# EAGLE schematic Tarjeta (EAGLE 9.6.2)

## Sheet 1 of 3
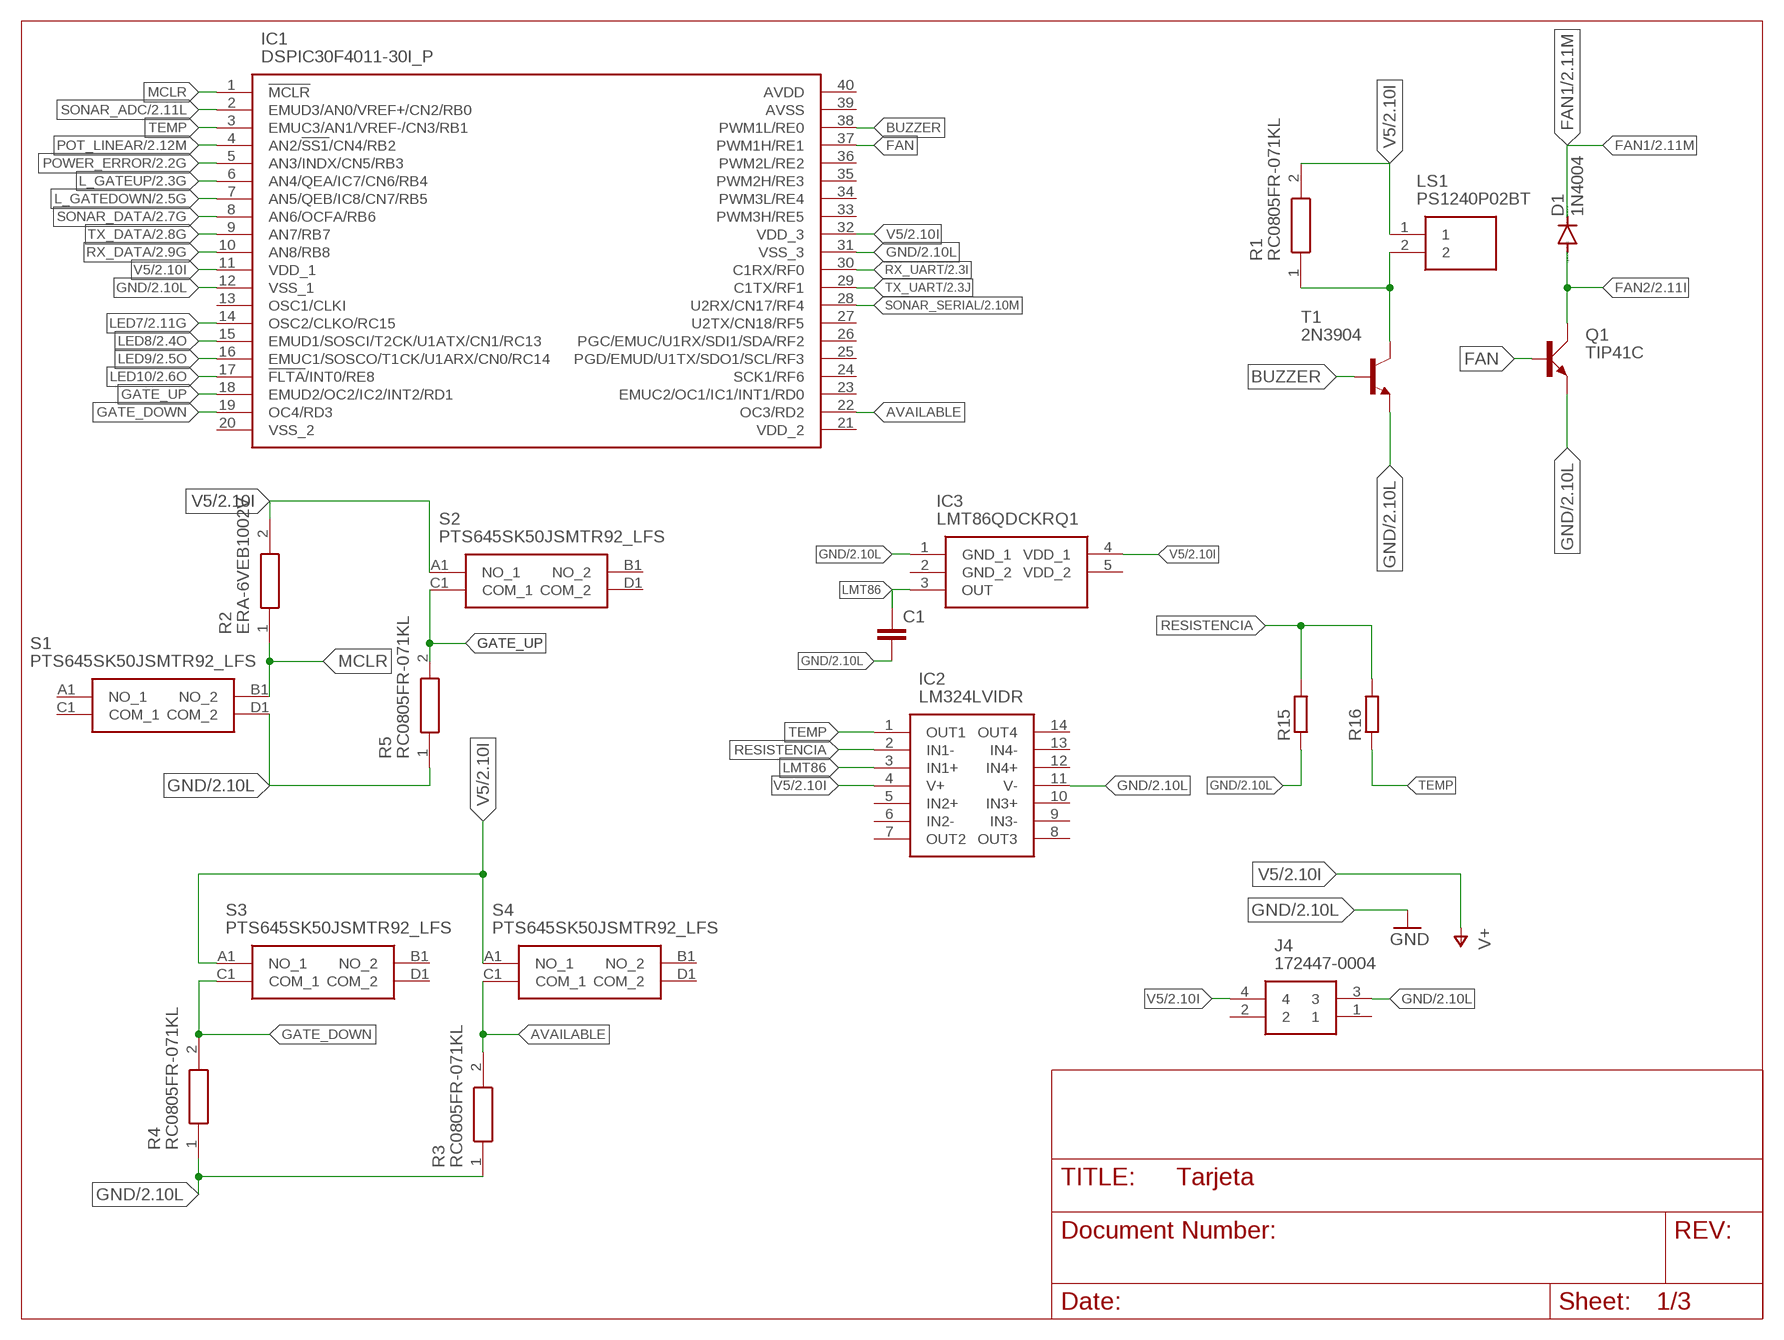
[diagram p0: schematic, sheet 1]

### Parts
C1  C-EUC0805  [C0805]
D1  1N4004  [DO41-10]
IC1  DSPIC30F4011-30I_P  [DIP1543W58P254L5175H635Q40N]
IC2  LM324LVIDR  [SOIC127P600X175-14N]
IC3  LMT86QDCKRQ1  [SOT65P210X110-5N]
J4  172447-0004  [1724470004]
LS1  PS1240P02BT  [PS1240P02BT]
Q1  TIP41C  [TO220AV]
R1  RC0805FR-071KL  [RESC2012X60N]
R2  ERA-6VEB1002V  [RESC2012X65N]
R3  RC0805FR-071KL  [RESC2012X60N]
R4  RC0805FR-071KL  [RESC2012X60N]
R5  RC0805FR-071KL  [RESC2012X60N]
R15  R-EU_0204/7  [0204/7]
R16  R-EU_0204/7  [0204/7]
S1  PTS645SK50JSMTR92_LFS  [PTS645SK50JSMTR92LFS]
S2  PTS645SK50JSMTR92_LFS  [PTS645SK50JSMTR92LFS]
S3  PTS645SK50JSMTR92_LFS  [PTS645SK50JSMTR92LFS]
S4  PTS645SK50JSMTR92_LFS  [PTS645SK50JSMTR92LFS]
T1  2N3904  [TO92]

### Nets
AVAILABLE: IC1.22(OC3/RD2) R3.2 S4.C1(COM_1)
BUZZER: IC1.38(PWM1L/RE0) T1.2(B)
FAN: IC1.37(PWM1H/RE1) Q1.B
FAN1: D1.C ; also sheet 2
FAN2: D1.A Q1.C ; also sheet 2
GATE_DOWN: IC1.19(OC4/RD3) R4.2 S3.C1(COM_1)
GATE_UP: IC1.18(EMUD2/OC2/IC2/INT2/RD1) R5.2 S2.C1(COM_1)
GND: C1.2 IC1.12(VSS_1) IC1.31(VSS_3) IC2.11(V-) IC3.1(GND_1) J4.3 Q1.E R3.1 R4.1 R5.1 R15.1 S1.D1(COM_2) T1.3(E) ; also sheet 2,3
L_GATEDOWN: IC1.7(AN5/QEB/IC8/CN7/RB5) ; also sheet 2
L_GATEUP: IC1.6(AN4/QEA/IC7/CN6/RB4) ; also sheet 2
LED7: IC1.14(OSC2/CLKO/RC15) ; also sheet 2
LED8: IC1.15(EMUD1/SOSCI/T2CK/U1ATX/CN1/RC13) ; also sheet 2
LED9: IC1.16(EMUC1/SOSCO/T1CK/U1ARX/CN0/RC14) ; also sheet 2
LED10: IC1.17(!FLTA!/INT0/RE8) ; also sheet 2
LMT86: C1.1 IC2.3(IN1+) IC3.3(OUT)
MCLR: IC1.1(!MCLR) R2.1 S1.B1(NO_2)
N$3: LS1.2 R1.1 T1.1(C)
POT_LINEAR: IC1.4(AN2/!SS1!/CN4/RB2) ; also sheet 2
POWER_ERROR: IC1.5(AN3/INDX/CN5/RB3) ; also sheet 2
RESISTENCIA: IC2.2(IN1-) R15.2 R16.2
RX_DATA: IC1.10(AN8/RB8) ; also sheet 2
RX_UART: IC1.30(C1RX/RF0) ; also sheet 2
SONAR_ADC: IC1.2(EMUD3/AN0/VREF+/CN2/RB0) ; also sheet 2
SONAR_DATA: IC1.8(AN6/OCFA/RB6) ; also sheet 2
SONAR_SERIAL: IC1.28(U2RX/CN17/RF4) ; also sheet 2
TEMP: IC1.3(EMUC3/AN1/VREF-/CN3/RB1) IC2.1(OUT1) R16.1
TX_DATA: IC1.9(AN7/RB7) ; also sheet 2
TX_UART: IC1.29(C1TX/RF1) ; also sheet 2
V5: IC1.11(VDD_1) IC1.32(VDD_3) IC2.4(V+) IC3.4(VDD_1) J4.4 LS1.1 R1.2 R2.2 S2.A1(NO_1) S3.A1(NO_1) S4.A1(NO_1) ; supply symbol labelled V+ ; also sheet 2,3
Unconnected: IC1.13(OSC1/CLKI) IC1.20(VSS_2) IC1.21(VDD_2) IC1.23(EMUC2/OC1/IC1/INT1/RD0) IC1.24(SCK1/RF6) IC1.25(PGD/EMUD/U1TX/SDO1/SCL/RF3) IC1.26(PGC/EMUC/U1RX/SDI1/SDA/RF2) IC1.27(U2TX/CN18/RF5) IC1.33(PWM3H/RE5) IC1.34(PWM3L/RE4) IC1.35(PWM2H/RE3) IC1.36(PWM2L/RE2) IC1.39(AVSS) IC1.40(AVDD) IC2.5(IN2+) IC2.6(IN2-) IC2.7(OUT2) IC2.8(OUT3) IC2.9(IN3-) IC2.10(IN3+) IC2.12(IN4+) IC2.13(IN4-) IC2.14(OUT4) IC3.2(GND_2) IC3.5(VDD_2) J4.1 J4.2 S1.A1(NO_1) S1.C1(COM_1) S2.B1(NO_2) S2.D1(COM_2) S3.B1(NO_2) S3.D1(COM_2) S4.B1(NO_2) S4.D1(COM_2)

## Sheet 2 of 3
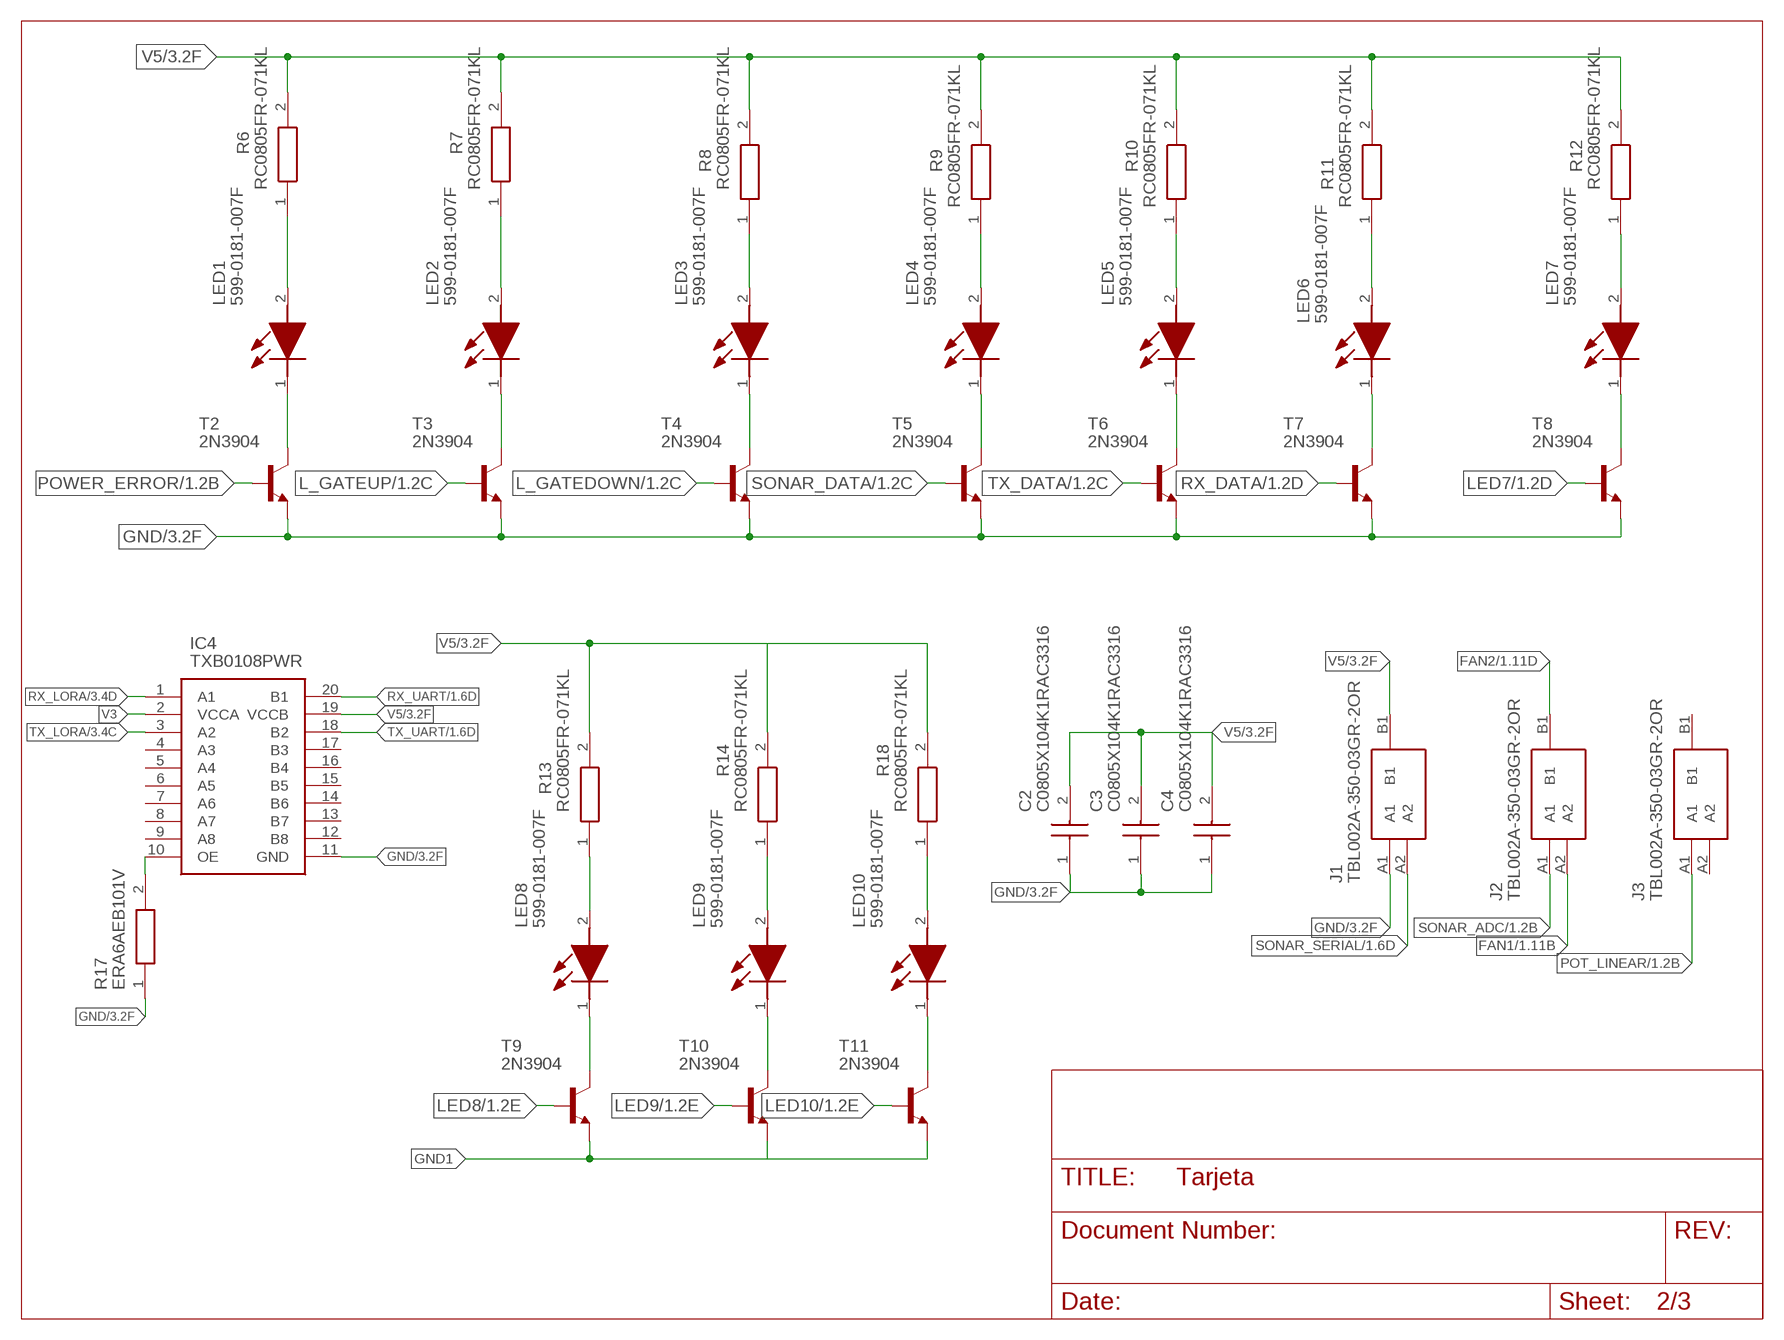
[diagram p1: schematic, sheet 2]

### Parts
C2  C0805X104K1RAC3316  [CAPC2012X100N]
C3  C0805X104K1RAC3316  [CAPC2012X100N]
C4  C0805X104K1RAC3316  [CAPC2012X100N]
IC4  TXB0108PWR  [SOP65P640X120-20N]
J1  TBL002A-350-03GR-2OR  [TBL002A35003GR2OR]
J2  TBL002A-350-03GR-2OR  [TBL002A35003GR2OR]
J3  TBL002A-350-03GR-2OR  [TBL002A35003GR2OR]
LED1  599-0181-007F  [LEDC2012X70N]
LED2  599-0181-007F  [LEDC2012X70N]
LED3  599-0181-007F  [LEDC2012X70N]
LED4  599-0181-007F  [LEDC2012X70N]
LED5  599-0181-007F  [LEDC2012X70N]
LED6  599-0181-007F  [LEDC2012X70N]
LED7  599-0181-007F  [LEDC2012X70N]
LED8  599-0181-007F  [LEDC2012X70N]
LED9  599-0181-007F  [LEDC2012X70N]
LED10  599-0181-007F  [LEDC2012X70N]
R6  RC0805FR-071KL  [RESC2012X60N]
R7  RC0805FR-071KL  [RESC2012X60N]
R8  RC0805FR-071KL  [RESC2012X60N]
R9  RC0805FR-071KL  [RESC2012X60N]
R10  RC0805FR-071KL  [RESC2012X60N]
R11  RC0805FR-071KL  [RESC2012X60N]
R12  RC0805FR-071KL  [RESC2012X60N]
R13  RC0805FR-071KL  [RESC2012X60N]
R14  RC0805FR-071KL  [RESC2012X60N]
R17  ERA6AEB101V  [RESC2012X60N]
R18  RC0805FR-071KL  [RESC2012X60N]
T2  2N3904  [TO92]
T3  2N3904  [TO92]
T4  2N3904  [TO92]
T5  2N3904  [TO92]
T6  2N3904  [TO92]
T7  2N3904  [TO92]
T8  2N3904  [TO92]
T9  2N3904  [TO92]
T10  2N3904  [TO92]
T11  2N3904  [TO92]

### Nets
FAN1: J2.A2 ; also sheet 1
FAN2: J2.B1 ; also sheet 1
GND: C2.1 C3.1 C4.1 IC4.11(GND) J1.A1 R17.1 T2.3(E) T3.3(E) T4.3(E) T5.3(E) T6.3(E) T7.3(E) T8.3(E) ; also sheet 1,3
GND1: T9.3(E) T10.3(E)
GND2: T11.3(E)
L_GATEDOWN: T4.2(B) ; also sheet 1
L_GATEUP: T3.2(B) ; also sheet 1
LED7: T8.2(B) ; also sheet 1
LED8: T9.2(B) ; also sheet 1
LED9: T10.2(B) ; also sheet 1
LED10: T11.2(B) ; also sheet 1
N$1: LED10.1(K) T11.1(C)
N$2: LED1.2(A) R6.1
N$4: LED1.1(K) T2.1(C)
N$5: LED2.1(K) T3.1(C)
N$6: LED2.2(A) R7.1
N$7: LED3.1(K) T4.1(C)
N$8: LED4.1(K) T5.1(C)
N$9: LED5.1(K) T6.1(C)
N$10: LED3.2(A) R8.1
N$11: LED4.2(A) R9.1
N$12: LED6.1(K) T7.1(C)
N$13: LED7.1(K) T8.1(C)
N$14: LED8.1(K) T9.1(C)
N$15: LED9.1(K) T10.1(C)
N$16: LED5.2(A) R10.1
N$17: LED6.2(A) R11.1
N$18: LED7.2(A) R12.1
N$19: LED8.2(A) R13.1
N$20: IC4.10(OE) R17.2
N$21: LED9.2(A) R14.1
N$22: LED10.2(A) R18.1
POT_LINEAR: J3.A1 ; also sheet 1
POWER_ERROR: T2.2(B) ; also sheet 1
RX_DATA: T7.2(B) ; also sheet 1
RX_LORA: IC4.1(A1) ; also sheet 3
RX_UART: IC4.20(B1) ; also sheet 1
SONAR_ADC: J2.A1 ; also sheet 1
SONAR_DATA: T5.2(B) ; also sheet 1
SONAR_SERIAL: J1.A2 ; also sheet 1
TX_DATA: T6.2(B) ; also sheet 1
TX_LORA: IC4.3(A2) ; also sheet 3
TX_UART: IC4.18(B2) ; also sheet 1
V1: R18.2
V3: IC4.2(VCCA)
V5: C2.2 C3.2 C4.2 IC4.19(VCCB) J1.B1 R6.2 R7.2 R8.2 R9.2 R10.2 R11.2 R12.2 R13.2 R14.2 ; also sheet 1,3
Unconnected: IC4.4(A3) IC4.5(A4) IC4.6(A5) IC4.7(A6) IC4.8(A7) IC4.9(A8) IC4.12(B8) IC4.13(B7) IC4.14(B6) IC4.15(B5) IC4.16(B4) IC4.17(B3) J3.A2 J3.B1

## Sheet 3 of 3
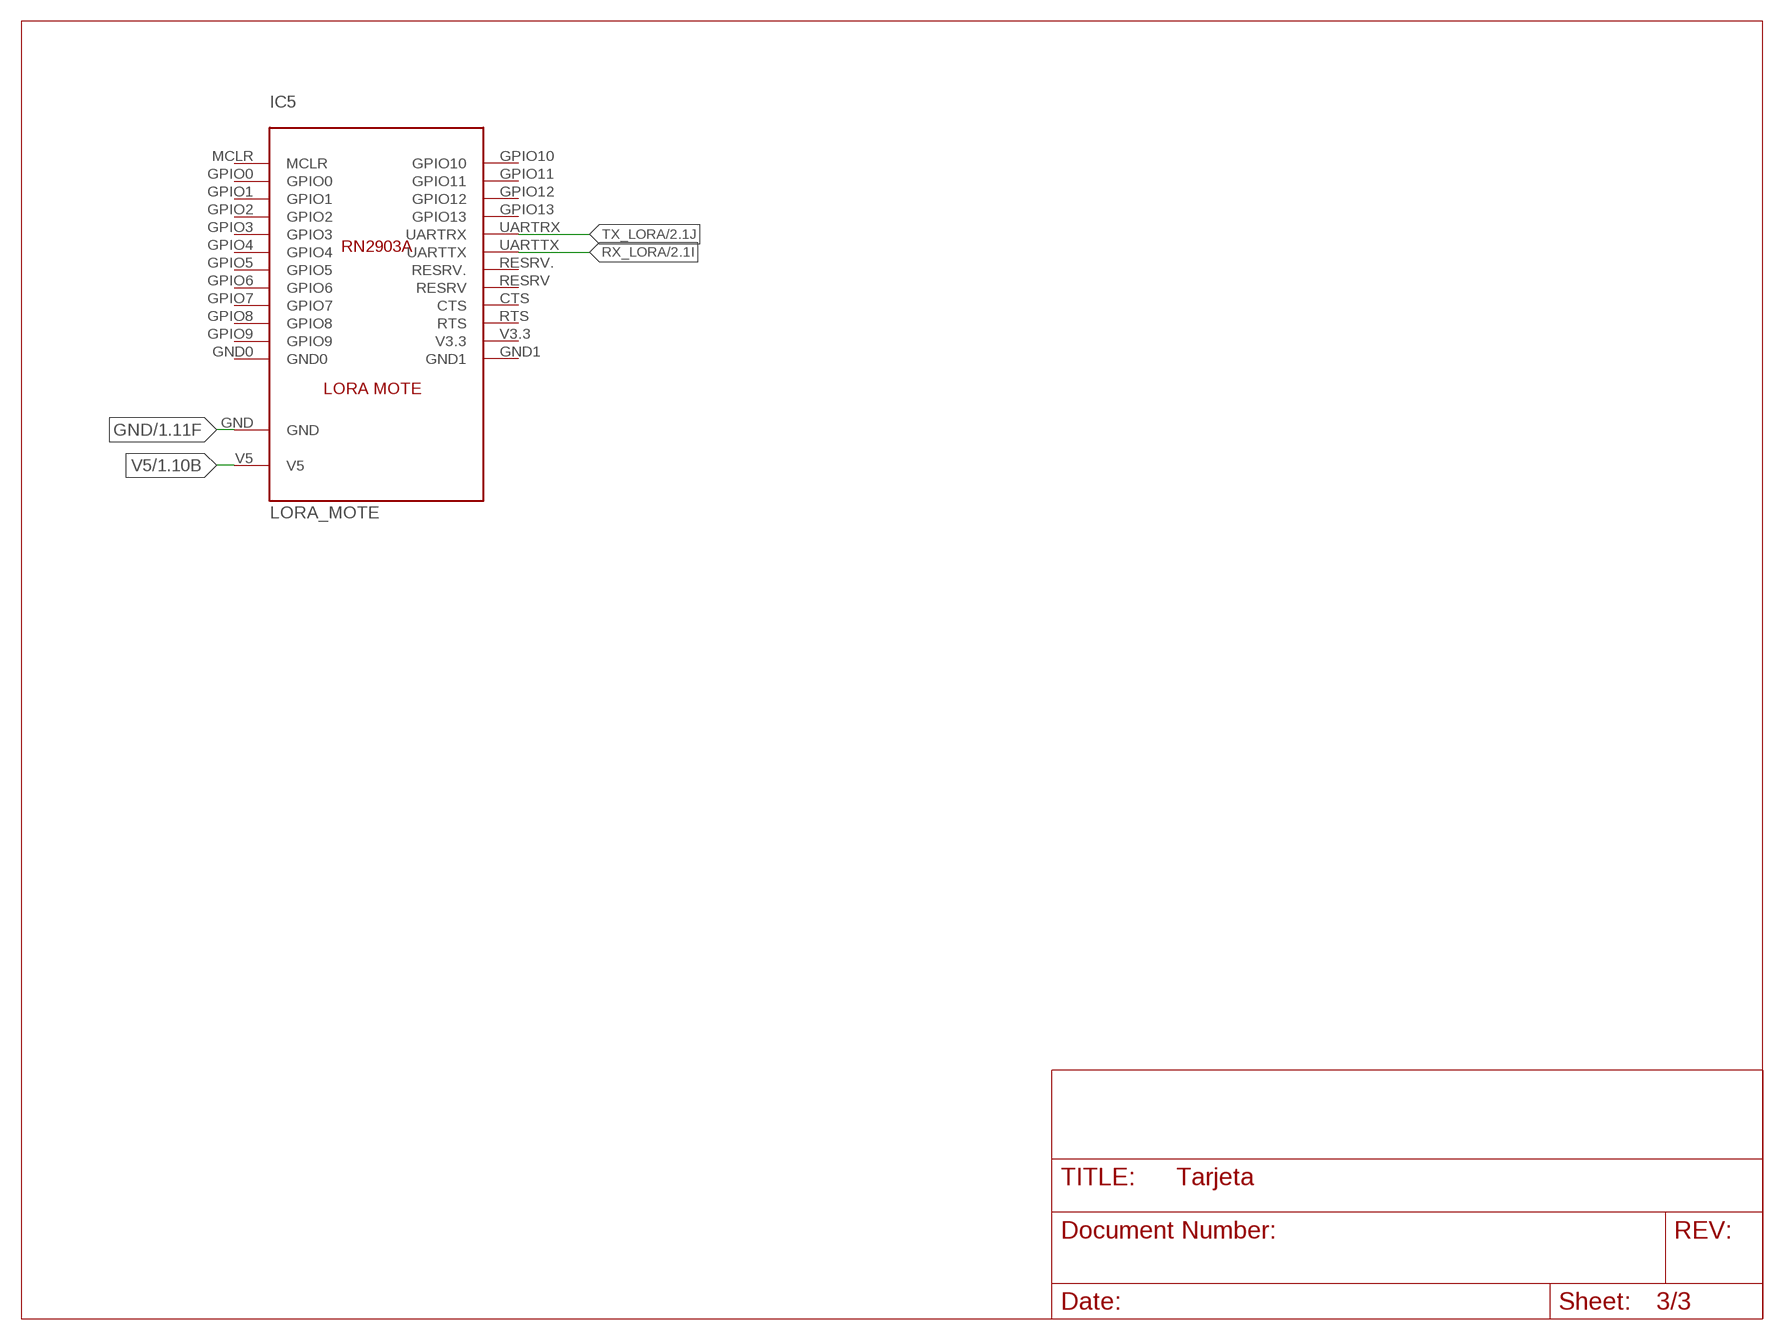
[diagram p2: schematic, sheet 3]

### Parts
IC5  LORA_MOTE  [LORA_MOTE_RN2903]

### Nets
GND: IC5.GND ; also sheet 1,2
RX_LORA: IC5.UARTTX ; also sheet 2
TX_LORA: IC5.UARTRX ; also sheet 2
V5: IC5.V5 ; also sheet 1,2
Unconnected: IC5.CTS IC5.GND0 IC5.GND1 IC5.GPIO0 IC5.GPIO1 IC5.GPIO2 IC5.GPIO3 IC5.GPIO4 IC5.GPIO5 IC5.GPIO6 IC5.GPIO7 IC5.GPIO8 IC5.GPIO9 IC5.GPIO10 IC5.GPIO11 IC5.GPIO12 IC5.GPIO13 IC5.MCLR IC5.RESRV IC5.RESRV. IC5.RTS IC5.V3.3

## Library data of the parts
C1 = rcl:C-EU: CAPACITOR, European symbol; SPICEPREFIX: C
C2-C4 = C0805X104K1RAC3316:C0805X104K1RAC3316: Multilayer Ceramic Capacitors MLCC - SMD/SMT 100V .1uF X7R AUTO 5mm Flex VW80808 Source: Datasheet <https://api.kemet.com/component-edge/download/datasheet/C0805X104K1RAC3316.pdf>; DESCRIPTION: Multilayer Ceramic Capacitors MLCC - SMD/SMT 100V .1uF X7R AUTO 5mm Flex VW80808; HEIGHT: 1mm; MANUFACTURER_NAME: Kemet; MANUFACTURER_PART_NUMBER: C0805X104K1RAC3316; MOUSER_PART_NUMBER: 80-C0805X104K1R3316; MOUSER_PRICE-STOCK: https://www.mouser.co.uk/ProductDetail/KEMET/C0805X104K1RAC3316/?qs=l7cgNqFNU1gwaeaoie4AnQ%3D%3D
D1 = diode:1N4004: DIODE general purpose rectifier, 1 A
IC1 = DSPIC30F4011-30I_P:DSPIC30F4011-30I_P: Digital Signal Controllers Source: Datasheet <https://componentsearchengine.com/Datasheets/5/DSPIC30F4011-30I_P.pdf>; ARROW_PART_NUMBER: dsPIC30F4011-30I/P; ARROW_PRICE-STOCK: https://www.arrow.com/en/products/dspic30f4011-30ip/microchip-technology; DESCRIPTION: Digital Signal Controllers; HEIGHT: 6.35mm; MANUFACTURER_NAME: Microchip; MANUFACTURER_PART_NUMBER: DSPIC30F4011-30I/P; MOUSER_PART_NUMBER: 579-30F4011-30I/P; MOUSER_PRICE-STOCK: https://www.mouser.co.uk/ProductDetail/Microchip-Technology/dsPIC30F4011-30I-P?qs=nMCt4TBfEwpnzUUd8LIZNg%3D%3D
IC2 = LM324LVIDR:LM324LVIDR: 4-Channel Industry Standard Low Voltage Operational Amplifier Source: Datasheet <http://www.ti.com/lit/gpn/lm324lv>; ARROW_PART_NUMBER: LM324LVIDR; ARROW_PRICE-STOCK: https://www.arrow.com/en/products/lm324lvidr/texas-instruments; DESCRIPTION: 4-Channel Industry Standard Low Voltage Operational Amplifier; HEIGHT: 1.75mm; MANUFACTURER_NAME: Texas Instruments; MANUFACTURER_PART_NUMBER: LM324LVIDR; MOUSER_PART_NUMBER: 595-LM324LVIDR; MOUSER_PRICE-STOCK: https://www.mouser.co.uk/ProductDetail/Texas-Instruments/LM324LVIDR/?qs=qSfuJ%252Bfl%2Fd62Uwb7PBNJ4g%3D%3D
IC3 = LMT86QDCKRQ1:LMT86QDCKRQ1: Automotive Grade, 2.2V-Capable, 10 uA Analog Output Temperature Sensor Source: Datasheet <http://www.ti.com/lit/gpn/lmt86-q1>; DESCRIPTION: Automotive Grade, 2.2V-Capable, 10 uA Analog Output Temperature Sensor; HEIGHT: 1.1mm; MANUFACTURER_NAME: Texas Instruments; MANUFACTURER_PART_NUMBER: LMT86QDCKRQ1; MOUSER_PART_NUMBER: 595-LMT86QDCKRQ1; MOUSER_PRICE-STOCK: https://www.mouser.co.uk/ProductDetail/Texas-Instruments/LMT86QDCKRQ1/?qs=xopfAcLiCQTZSXomKixV%2FQ%3D%3D
IC4 = TXB0108PWR:TXB0108PWR: 8-Bit Bidirectional Voltage-Level Shifter with Auto Direction Sensing and +/-15-kV ESD Protect Source: Datasheet <http://www.ti.com/lit/ds/symlink/txb0108.pdf>; DESCRIPTION: 8-Bit Bidirectional Voltage-Level Shifter with Auto Direction Sensing and +/-15-kV ESD Protect; HEIGHT: 1.2mm; MANUFACTURER_NAME: Texas Instruments; MANUFACTURER_PART_NUMBER: TXB0108PWR; MOUSER_PART_NUMBER: 595-TXB0108PWR; MOUSER_PRICE-STOCK: https://www.mouser.co.uk/ProductDetail/Texas-Instruments/TXB0108PWR/?qs=oFXvjAmG9EgEUWGWzOVFCA%3D%3D
IC5 = LORA_MOTE:LORA_MOTE
J1-J3 = TBL002A-350-03GR-2OR:TBL002A-350-03GR-2OR: Fixed Terminal Blocks Terminal block, screwless, 3.50, 45, 3 poles, green w orange tab Source: Datasheet <https://www.mouser.fr/datasheet/2/670/tbl002a-350-1600859.pdf>; DESCRIPTION: Fixed Terminal Blocks Terminal block, screwless, 3.50, 45, 3 poles, green w orange tab; HEIGHT: 12.85mm; MANUFACTURER_NAME: CUI Inc.; MANUFACTURER_PART_NUMBER: TBL002A-350-03GR-2OR; MOUSER_PART_NUMBER: 490-TBL002A3503GR2OR; MOUSER_PRICE-STOCK: https://www.mouser.co.uk/ProductDetail/CUI-Devices/TBL002A-350-03GR-2OR?qs=PzGy0jfpSMsNR2AeoCll%252Bw%3D%3D
J4 = 172447-0004:172447-0004: Power to the Board MiniFitJr Vert Hdr w/Pegs 4Ckt GlowWire Source: Datasheet <https://componentsearchengine.com/Datasheets/1/172447-0004.pdf>; DESCRIPTION: Power to the Board MiniFitJr Vert Hdr w/Pegs 4Ckt GlowWire; HEIGHT: 13.3mm; MANUFACTURER_NAME: Molex; MANUFACTURER_PART_NUMBER: 172447-0004; MOUSER_PART_NUMBER: 538-172447-0004; MOUSER_PRICE-STOCK: https://www.mouser.com/Search/Refine.aspx?Keyword=538-172447-0004
LED1-LED10 = 599-0181-007F:599-0181-007F: Standard LEDs - SMD SMD 0805 GREEN Source: Datasheet <http://www.mouser.com/datasheet/2/109/Dialight_CBI_data_599-0805_Apr2018-1370606.pdf>; DESCRIPTION: Standard LEDs - SMD SMD 0805 GREEN; HEIGHT: 0.7mm; MANUFACTURER_NAME: Dialight; MANUFACTURER_PART_NUMBER: 599-0181-007F; MOUSER_PART_NUMBER: 645-599-0181-007F; MOUSER_PRICE-STOCK: https://www.mouser.co.uk/ProductDetail/Dialight/599-0181-007F?qs=gTYE2QTfZfRUSax8JbgA2w%3D%3D
LS1 = PS1240P02BT:PS1240P02BT: Audio Indicators & Alerts Round 12.2mmx6.5mm 4kHz Vin=3V Source: Datasheet; DESCRIPTION: Audio Indicators & Alerts Round 12.2mmx6.5mm 4kHz Vin=3V; HEIGHT: mm; MANUFACTURER_NAME: TDK; MANUFACTURER_PART_NUMBER: PS1240P02BT; MOUSER_PART_NUMBER: 810-PS1240P02BT; MOUSER_PRICE-STOCK: https://www.mouser.co.uk/ProductDetail/TDK/PS1240P02BT/?qs=d7g9p1yFhWaZXSY9MjKMkw%3D%3D
Q1 = transistor-power:TIP41C: NPN TRANSISTOR
R1 R3-R14 R18 = RC0805FR-071KL:RC0805FR-071KL: GENERAL PURPOSE CHIP RESISTORS Source: Datasheet <http://www.yageo.com/documents/recent/PYu-RC_Group_51_RoHS_L_10.pdf>; DESCRIPTION: GENERAL PURPOSE CHIP RESISTORS; HEIGHT: 0.6mm; MANUFACTURER_NAME: YAGEO (PHYCOMP); MANUFACTURER_PART_NUMBER: RC0805FR-071KL; MOUSER_PART_NUMBER: 603-RC0805FR-071KL; MOUSER_PRICE-STOCK: https://www.mouser.co.uk/ProductDetail/Yageo/RC0805FR-071KL?qs=1ogmaHw32WJjeGY0DHXakQ%3D%3D
R2 = ERA-6VEB1002V:ERA-6VEB1002V: Thin Film Resistors - SMD 0805 0.1% 10Kohm 25ppm SMD Source: Datasheet <https://componentsearchengine.com/Datasheets/2/ERA-6VEB1002V.pdf>; DESCRIPTION: Thin Film Resistors - SMD 0805 0.1% 10Kohm 25ppm SMD; HEIGHT: 0.65mm; MANUFACTURER_NAME: Panasonic; MANUFACTURER_PART_NUMBER: ERA-6VEB1002V; MOUSER_PART_NUMBER: 667-ERA-6VEB1002V; MOUSER_PRICE-STOCK: https://www.mouser.co.uk/ProductDetail/Panasonic/ERA-6VEB1002V?qs=rI7uf1IzohQqQPsypW%252B%252B1w%3D%3D
R15 R16 = rcl:R-EU_: RESISTOR, European symbol; SPICEPREFIX: R
R17 = ERA6AEB101V:ERA6AEB101V: Panasonic ERA Series Thin Film Surface Mount Resistor 0805 Case 100 +/-0.1% 0.125W +/-25ppm/C Source: Datasheet <https://industrial.panasonic.com/cdbs/www-data/pdf/RDM0000/AOA0000C307.pdf>; ARROW_PART_NUMBER: ERA6AEB101V; ARROW_PRICE-STOCK: https://www.arrow.com/en/products/era-6aeb101v/panasonic; DESCRIPTION: Panasonic ERA Series Thin Film Surface Mount Resistor 0805 Case 100 +/-0.1% 0.125W +/-25ppm/C; HEIGHT: 0.6mm; MANUFACTURER_NAME: Panasonic; MANUFACTURER_PART_NUMBER: ERA6AEB101V
S1-S4 = Switche button:PTS645SK50JSMTR92_LFS: Tactile Switches 50mA 12VDC, SPST NO, 260 gf, 5.0mm H, SMT J-type Source: Datasheet <https://www.digikey.in/product-detail/en/c-k/PTS645SK50JSMTR92-LFS/108-PTS645SK50JSMTR92LFSCT-ND/12163485>; DESCRIPTION: Tactile Switches 50mA 12VDC, SPST NO, 260 gf, 5.0mm H, SMT J-type; HEIGHT: 5mm; MANUFACTURER_NAME: C & K COMPONENTS; MANUFACTURER_PART_NUMBER: PTS645SK50JSMTR92 LFS; MOUSER_PART_NUMBER: 611-SK50JSMTR92LFS; MOUSER_PRICE-STOCK: https://www.mouser.co.uk/ProductDetail/CK/PTS645SK50JSMTR92-LFS?qs=TiOZkKH1s2Tk7%252B%2Fs4hXb%252Bw%3D%3D
T1-T11 = transistor-neu-to92:2N3904: NPN TRANSISTOR